# Altium schematic sheet kr1_2.SchDoc
size 420 x 297 mm; SheetNumber: 1; SheetTotal: 1
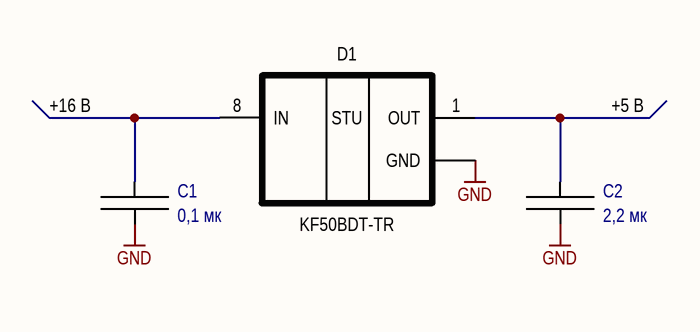
[diagram p0: kr1_2.SchDoc]

## Parts
C1  value 0,1 мк  (hidden comment: 0,1 мкФ ±* * * *, *)
C2  value 2,2 мк  (hidden comment: 2,2 мкФ ±* * * *, *)
D1  KF50BDT-TR

## Nets
GND: C1.1 C2.1 D1.?1(GND)
NetC1_2: C1.2 D1.8(IN)
NetC2_2: C2.2 D1.1(OUT)

## Notes on the sheet
- +16 В
- +5 В
- Перв.примен.
- Справ. №
- Подп. и дата
- Инв.№ дубл.
- Взам. инв. №
- Изм.
- Лист
- № докум.
- Подп.
- Дата
- Лит.
- Масса
- Масштаб
- Пров.
- Т.контр
- Разраб.
- Схема электрическая принципиальная
- 1
- Листов
- Инв № подл.
- Н.контр.
- Утв.
- Копировал
- Формат А3
- (in symbol KF50BDT-TR) STU

## Library data of the parts
C1 C2 = C: Company: *; PartNumber: *; Tolerance: *; Voltage: *; Type: *; Package: *